# EAGLE schematic PCB dol (EAGLE 9.6.2)
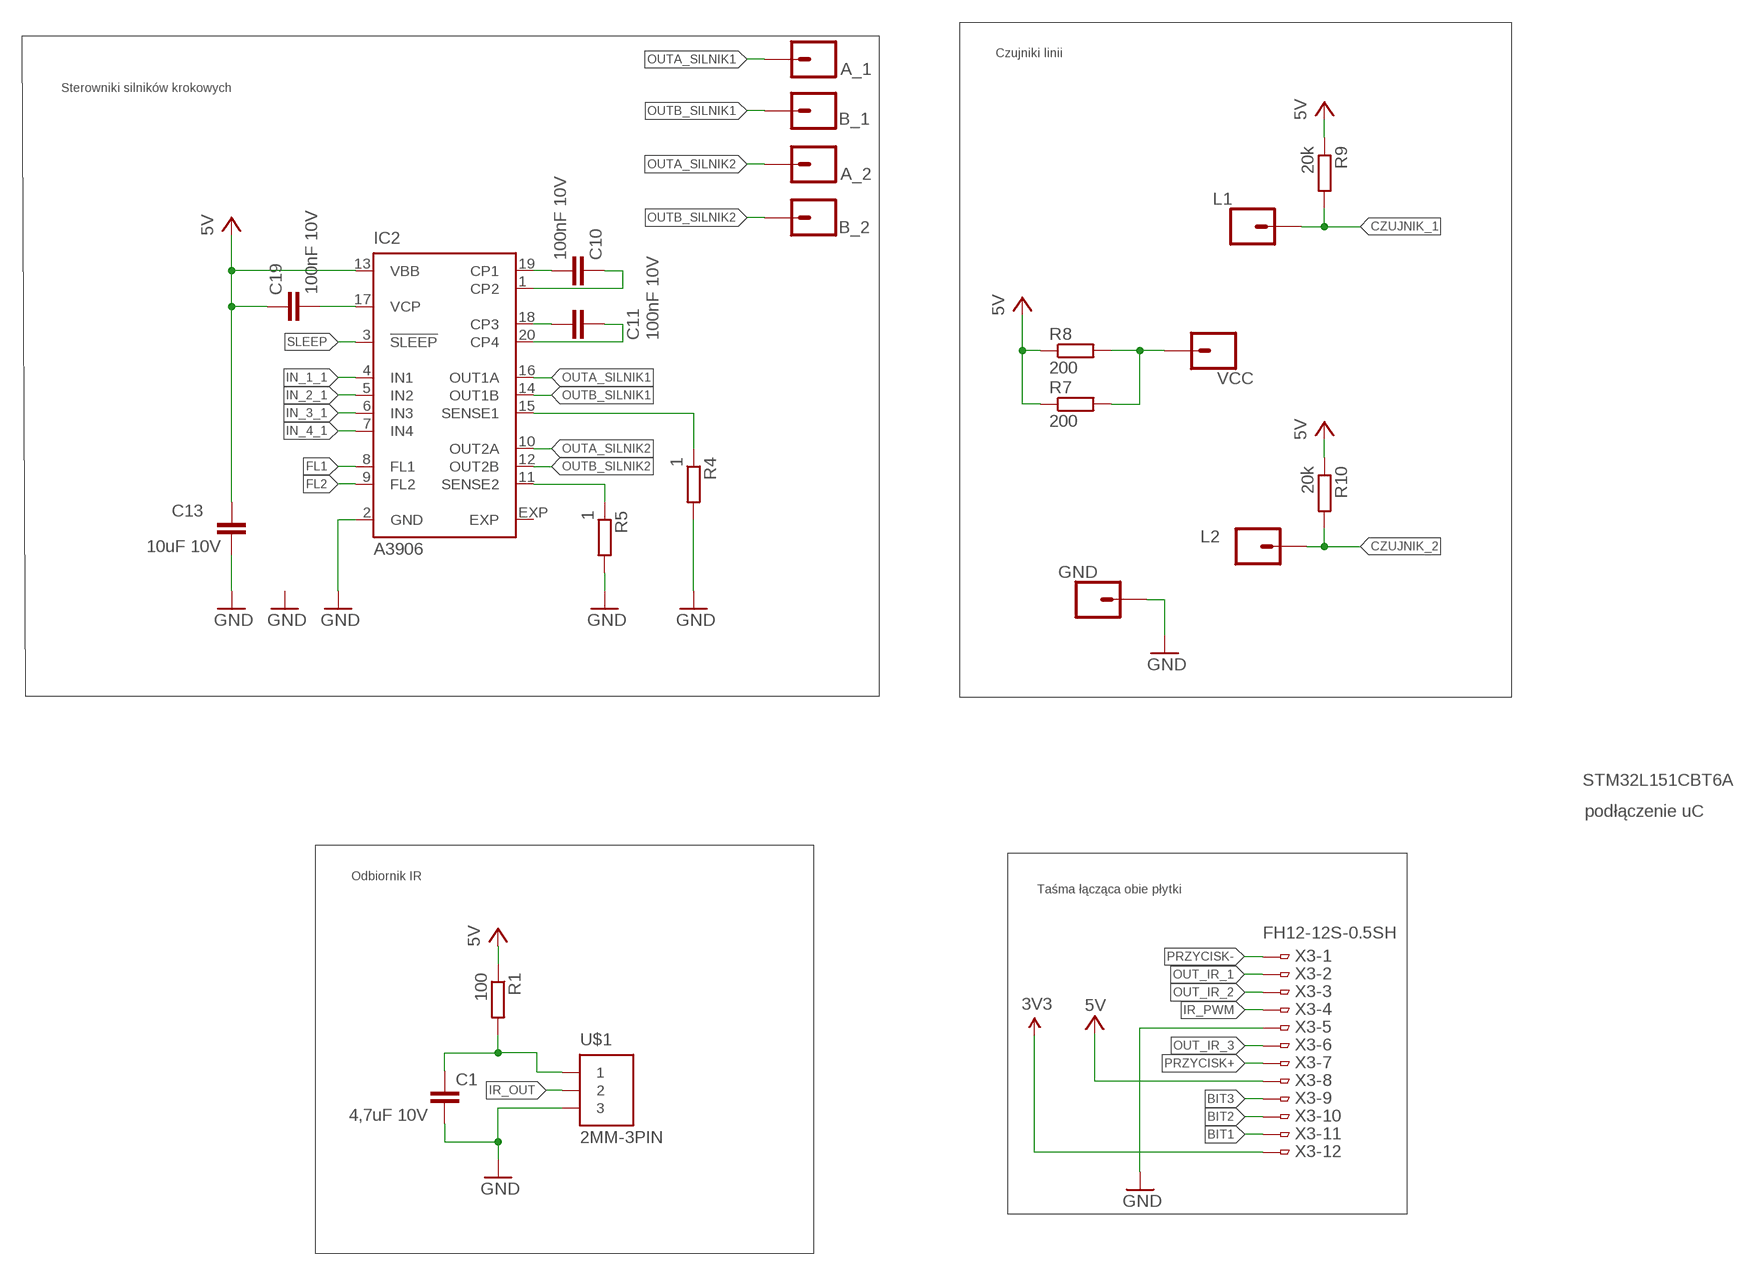
[diagram p0: schematic, sheet 1, part 1 of 2]
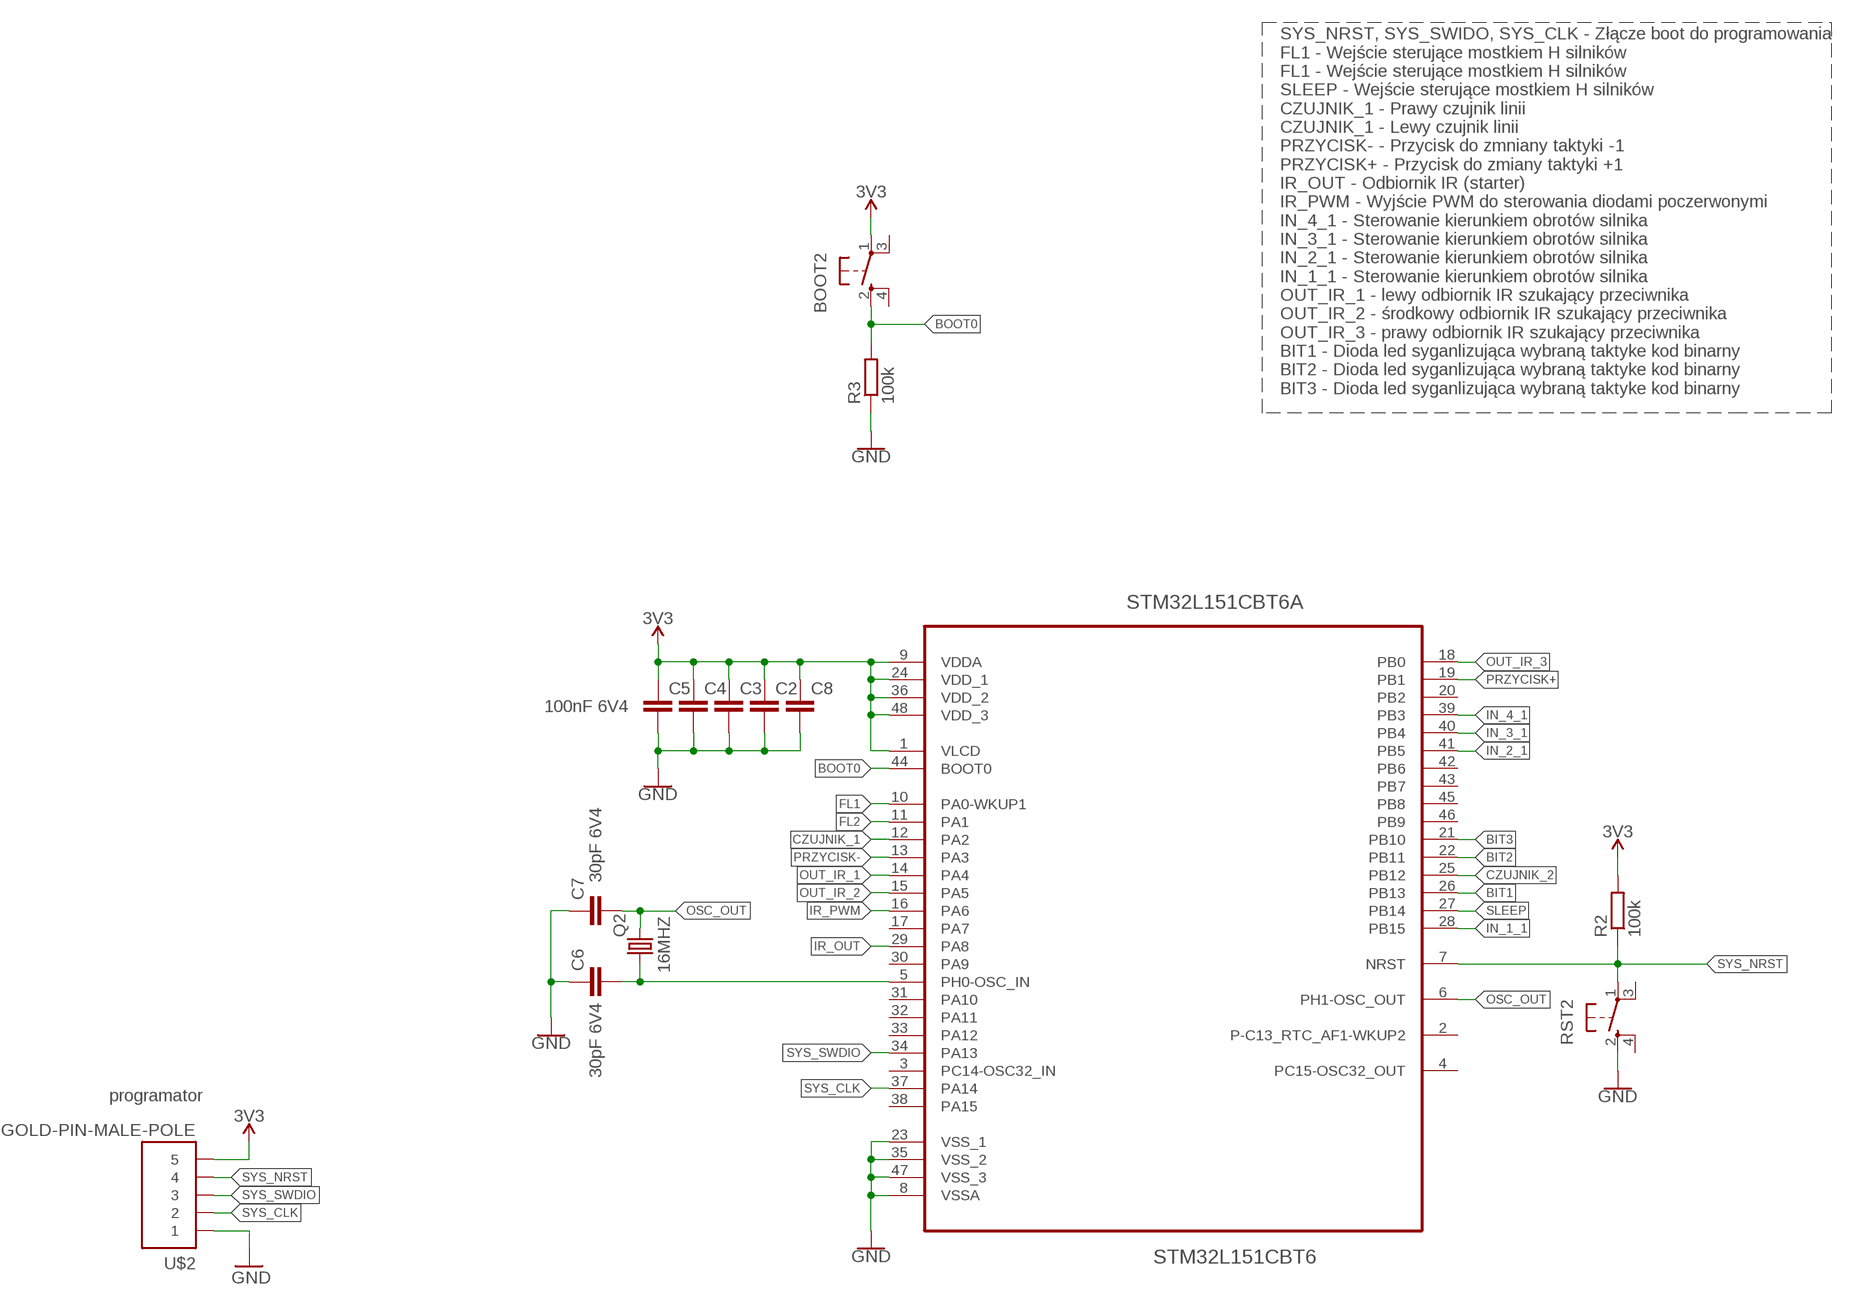
[diagram p1: schematic, sheet 1, part 2 of 2]

## Parts
A_1  CONN_01PTH_NO_SILK_KIT  [1X01NS_KIT]
A_2  CONN_01PTH_NO_SILK_KIT  [1X01NS_KIT]
B_1  CONN_01PTH_NO_SILK_KIT  [1X01NS_KIT]
B_2  CONN_01PTH_NO_SILK_KIT  [1X01NS_KIT]
BOOT2  SPST_TACT-KMR2  [KMR2]
C1  4,7uF 10V  C-EUC0402  [C0402]
C2  100nF 6V4  C-EUC0402  [C0402]
C3  100nF 6V4  C-EUC0402  [C0402]
C4  100nF 6V4  C-EUC0402  [C0402]
C5  100nF 6V4  C-EUC0402  [C0402]
C6  30pF 6V4  C-EUC0402  [C0402]
C7  30pF 6V4  C-EUC0402  [C0402]
C8  100nF 6V4  C-EUC0402  [C0402]
C10  100nF 10V  C-EUC0402  [C0402]
C11  100nF 10V  C-EUC0402  [C0402]
C13  10uF 10V  C-EUC0402  [C0402]
C19  100nF 10V  C-EUC0402  [C0402]
GND  CONN_01PTH_NO_SILK_KIT  [1X01NS_KIT]
IC2  A3906  [QFN20]
L1  CONN_01PTH_NO_SILK_KIT  [1X01NS_KIT]
L2  CONN_01PTH_NO_SILK_KIT  [1X01NS_KIT]
Q2  16MHZ  KX-7  [3.2X2.5_KX-7]
R1  100  R-EU_R0402  [R0402]
R2  100k  R-EU_R0402  [R0402]
R3  100k  R-EU_R0402  [R0402]
R4  1  R-EU_R0402  [R0402]
R5  1  R-EU_R0402  [R0402]
R7  200  R-EU_R0805  [R0805]
R8  200  R-EU_R0805  [R0805]
R9  20k  R-EU_R0402  [R0402]
R10  20k  R-EU_R0402  [R0402]
RST2  SPST_TACT-KMR2  [KMR2]
STM32L151CBT6A  STM32L151CBT6  [QFP50P900X900X160-48N]
U$1  2MM-3PIN  [2MM-3PIN]
U$2  GOLD-PIN-MALE-POLE  [PIN5]
VCC  CONN_01PTH_NO_SILK_KIT  [1X01NS_KIT]
X3  FH12-12S-0.5SH  [FH12-12S-0.5SH]

## Nets
3.3V: BOOT2.1(P) C2.1 C3.1 C4.1 C5.1 C8.1 R2.2 STM32L151CBT6A.1(VLCD) STM32L151CBT6A.9(VDDA) STM32L151CBT6A.24(VDD_1) STM32L151CBT6A.36(VDD_2) STM32L151CBT6A.48(VDD_3) U$2.P$5 X3.12 ; supply symbol labelled 3V3
BIT1: STM32L151CBT6A.26(PB13) X3.11
BIT2: STM32L151CBT6A.22(PB11) X3.10
BIT3: STM32L151CBT6A.21(PB10) X3.9
BOOT0: BOOT2.2(S) R3.2 STM32L151CBT6A.44(BOOT0)
CZUJNIK_1: L1.1 R9.2 STM32L151CBT6A.12(PA2)
CZUJNIK_2: L2.1 R10.2 STM32L151CBT6A.25(PB12)
FL1: IC2.8(FL1) STM32L151CBT6A.10(PA0-WKUP1)
FL2: IC2.9(FL2) STM32L151CBT6A.11(PA1)
GND: C1.2 C2.2 C3.2 C4.2 C5.2 C6.1 C7.1 C8.2 C13.1 GND.1 IC2.2(GND) R3.1 R4.2 R5.2 RST2.2(S) STM32L151CBT6A.8(VSSA) STM32L151CBT6A.23(VSS_1) STM32L151CBT6A.35(VSS_2) STM32L151CBT6A.47(VSS_3) U$1.P$3 U$2.P$1 X3.5
IN_1_1: IC2.4(IN1) STM32L151CBT6A.28(PB15)
IN_2_1: IC2.5(IN2) STM32L151CBT6A.41(PB5)
IN_3_1: IC2.6(IN3) STM32L151CBT6A.40(PB4)
IN_4_1: IC2.7(IN4) STM32L151CBT6A.39(PB3)
IR_OUT: STM32L151CBT6A.29(PA8) U$1.P$2
IR_PWM: STM32L151CBT6A.16(PA6) X3.4
N$1: C6.2 Q2.1 STM32L151CBT6A.5(PH0-OSC_IN)
N$2: C1.1 R1.2 U$1.P$1
N$3: IC2.11(SENSE2) R5.1
N$4: C10.2 IC2.1(CP2)
N$5: C11.2 IC2.20(CP4)
N$6: IC2.15(SENSE1) R4.1
N$12: R7.2 R8.2 VCC.1
N$26: C10.1 IC2.19(CP1)
N$27: C11.1 IC2.18(CP3)
N$32: C19.1 IC2.17(VCP)
OSC_OUT: C7.2 Q2.3 STM32L151CBT6A.6(PH1-OSC_OUT)
OUT_IR_1: STM32L151CBT6A.14(PA4) X3.2
OUT_IR_2: STM32L151CBT6A.15(PA5) X3.3
OUT_IR_3: STM32L151CBT6A.18(PB0) X3.6
OUTA_SILNIK1: A_1.1 IC2.16(OUT1A)
OUTA_SILNIK2: A_2.1 IC2.10(OUT2A)
OUTB_SILNIK1: B_1.1 IC2.14(OUT1B)
OUTB_SILNIK2: B_2.1 IC2.12(OUT2B)
PRZYCISK+: STM32L151CBT6A.19(PB1) X3.7
PRZYCISK-: STM32L151CBT6A.13(PA3) X3.1
SLEEP: IC2.3(!SLEEP) STM32L151CBT6A.27(PB14)
SYS_CLK: STM32L151CBT6A.37(PA14) U$2.P$2
SYS_NRST: R2.1 RST2.1(P) STM32L151CBT6A.7(NRST) U$2.P$4
SYS_SWDIO: STM32L151CBT6A.34(PA13) U$2.P$3
VCC: C13.2 C19.2 IC2.13(VBB) R1.1 R7.1 R8.1 R9.1 R10.1 X3.8 ; supply symbol labelled 5V
Unconnected: BOOT2.3(P1) BOOT2.4(S1) IC2.EXP RST2.3(P1) RST2.4(S1) STM32L151CBT6A.2(P-C13_RTC_AF1-WKUP2) STM32L151CBT6A.3(PC14-OSC32_IN) STM32L151CBT6A.4(PC15-OSC32_OUT) STM32L151CBT6A.17(PA7) STM32L151CBT6A.20(PB2) STM32L151CBT6A.30(PA9) STM32L151CBT6A.31(PA10) STM32L151CBT6A.32(PA11) STM32L151CBT6A.33(PA12) STM32L151CBT6A.38(PA15) STM32L151CBT6A.42(PB6) STM32L151CBT6A.43(PB7) STM32L151CBT6A.45(PB8) STM32L151CBT6A.46(PB9)

## Notes on the sheet
- Czujniki linii
- Sterowniki silników krokowych
- SYS_NRST, SYS_SWIDO, SYS_CLK - Złącze boot do programowania
  FL1 - Wejście sterujące mostkiem H silników
  FL1 - Wejście sterujące mostkiem H silników
  SLEEP - Wejście sterujące mostkiem H silników
  CZUJNIK_1 - Prawy czujnik linii
  CZUJNIK_1 - Lewy czujnik linii
  PRZYCISK- - Przycisk do zmniany taktyki -1
  PRZYCISK+ - Przycisk do zmiany taktyki +1
  IR_OUT - Odbiornik IR (starter)
  IR_PWM - Wyjście PWM do sterowania diodami poczerwonymi
  IN_4_1 - Sterowanie kierunkiem obrotów silnika
  IN_3_1 - Sterowanie kierunkiem obrotów silnika
  IN_2_1 - Sterowanie kierunkiem obrotów silnika
  IN_1_1 - Sterowanie kierunkiem obrotów silnika
  OUT_IR_1 - lewy odbiornik IR szukający przeciwnika
  OUT_IR_2 - środkowy odbiornik IR szukający przeciwnika
  OUT_IR_3 - prawy odbiornik IR szukający przeciwnika
  BIT1 - Dioda led syganlizująca wybraną taktyke kod binarny
  BIT2 - Dioda led syganlizująca wybraną taktyke kod binarny
  BIT3 - Dioda led syganlizująca wybraną taktyke kod binarny
- STM32L151CBT6A
- podłączenie uC
- Odbiornik IR
- Taśma łącząca obie płytki
- programator

## Library data of the parts
A_1 A_2 B_1 B_2 GND L1 L2 VCC = SparkFun-Connectors:CONN_01: Single connection point. Often used as Generic Header-pin footprint for 0.1 inch spaced/style header connections On any of the 0.1 inch spaced packages, you can populate with these: Break Away Headers - Straight <https://www.sparkfun.com/products/116> (PRT-00116) Break Away Male Headers - Right Angle <https://www.sparkfun.com/products/553> (PRT-00553) Female Headers <https://www.sparkfun.com/products/115> (PRT-00115) Break Away Headers - Machine Pin <https://www.sparkfun.com/products/117> (PRT-00117) Break Away Female Headers - Swiss Machine Pin <https://www.sparkfun.com/products/743> (PRT-00743) This device is also useful as a general connection point to wire up your design to another part of your project. Our various solder wires solder well into these plated through hole pads. Hook-Up Wire - Assortment (Stranded, 22 AWG) <https://www.sparkfun.com/products/11375> (PRT-11375) Hook-Up Wire - Assortment (Solid Core, 22 AWG) <https://www.sparkfun.com/products/11367> (PRT-11367) View the entire wire category on our website here <https://www.sparkfun.com/categories/141> Special notes: SMTSO-256-ET is a "flush mount" nut for a 4-40 screw. We mostly use this on specialty testbeds; it is a nice way to connect hardware to your PCB at an adjustable hieght. Also note, the SNAP packages are for using a snappable style connector. We sell a baggie of snaps and they are also used on two LilyPad designs: Snap Assortment - 30 pack (male and female) <https://www.sparkfun.com/products/11347> (DEV-11347) LilyPad Arduino SimpleSnap <https://www.sparkfun.com/products/10941> (DEV-10941) LilyPad SimpleSnap Protoboard <https://www.sparkfun.com/products/10940> (DEV-10940)
BOOT2 RST2 = adafruit:SPST_TACT: SMT 6mm switch, EVQQ2 series http://www.ladyada.net/library/eagle
C1-C8 C10 C11 C13 C19 = rcl:C-EU: CAPACITOR, European symbol; SPICEPREFIX: C
IC2 = allegro:A3906: Low Voltage Stepper and Single/Dual DC Motor Driver Data Sheet <http://www.allegromicro.com/en/Products/Part_Numbers/3906/3906.pdf>
Q2 = crystal-geyer_V1_0:KX: Quartz Crystals (MHz) SMD: KX - Serie Model Size l/w/h [mm] Frequency Range Frequency Stability Temp. Range [°C] Load Capacitance AECQ 200 availabel Datasheet KX-4 KX-5 KX-6 KX-7 KX-9A KX-9B KX-12A KX-12B KX-13 KX-20 KX-K KX-KS 1.6/1.2/0.3 2.0/1.6/0.45 2.5/2.0/0.55 3.2/2.5/0.8 5.0/3.2/1.0 5.0/3.2/1.1 6.0/3.5/1.1 6.0/3.5/1.0 7.0/5.0 /1.3 11.6/5.5/1.6 12.3/4.5/4.2 12.3/4.5/3.2 24.0 ~ 80.0 MHz 16.0 ~ 80.0 MHz 12.0 ~ 80.0 MHz 8.0 ~ 60.0 MHz 7,68 ~ 300,0 MHz 8,0 ~ 50,0 MHz 8,0 ~ 150,0 MHz 8,0 ~ 50,0 MHz 6,0 ~ 160,0 MHz 3,579 ~ 25,0 MHz 3,579 ~ 70,0 MHz 3,579 ~ 70,0 MHz ±10 … ±50ppm ±10 … ±50ppm ±10 … ±50ppm ±10 … ±50ppm ±10 … ±50ppm ±10 … ±50ppm ±10 … ±50ppm ±10 … ±50ppm ±10 … ±50ppm ±50ppm ±10 … ±50ppm ±10 … ±50ppm (*) -40°C …+85°C (*) -40°C …+125°C (*) -40°C …+125°C (*) -40°C …+125°C (*) -40°C …+105°C (*) -40°C …+105°C (*) -40°C …+125°C (*) -40°C …+105°C (*) -40°C …+105°C (*) -40°C …+105°C (*) -40°C …+85°C (*) -40°C …+85°C 8, 8…16 8, 8…16 10, 8…16 12, 7…20 16, 10…20 16, 10…20 16, 10…20 16, 12…20 16, 12…20 16, 12…20 16, 12…30 16, 12…30 - yes yes yes - - - - - - - - KX-4.pdf <http://www.geyer-electronic.de/uploads/tx_userartikelfrequenz/GEYER-KX-4.pdf> KX-5.pdf <http://www.geyer-electronic.de/uploads/tx_userartikelfrequenz/GEYER-KX-5.pdf> KX-6.pdf <http://www.geyer-electronic.de/uploads/tx_userartikelfrequenz/GEYER-KX-6.pdf> KX-7.pdf <http://www.geyer-electronic.de/uploads/tx_userartikelfrequenz/GEYER-KX-7.pdf> KX-9A.pdf <http://www.geyer-electronic.de/uploads/tx_userartikelfrequenz/GEYER-KX-9A.pdf> KX-9B.pdf <http://www.geyer-electronic.de/uploads/tx_userartikelfrequenz/GEYER-KX-9B.pdf> KX-12A.pdf <http://www.geyer-electronic.de/uploads/tx_userartikelfrequenz/GEYER-KX-12A.pdf> KX-12B.pdf <http://www.geyer-electronic.de/uploads/tx_userartikelfrequenz/GEYER-KX-12B.pdf> KX-13.pdf <http://www.geyer-electronic.de/uploads/tx_userartikelfrequenz/GEYER-KX-13.pdf> KX-20.pdf <http://www.geyer-electronic.de/uploads/tx_userartikelfrequenz/GEYER-KX-20.pdf> KX-K.pdf <http://www.geyer-electronic.de/uploads/tx_userartikelfrequenz/GEYER-KX-K.pdf> KX-KS.pdf <http://www.geyer-electronic.de/uploads/tx_userartikelfrequenz/GEYER-KX-KS.pdf> <http://www.geyer-electronic.de/fileadmin/template/img/logo-geyer-electronic.png> Details see: http://www.geyer-electronic.de/Frequenz-Produkte.9.0.html Created 2016-06-07, Hans Locher 2016 (C) Geyer Quartz Technology KX4,KX5,KX6,KX7,KX9A,KX9B,KX12A,KX12B,KX13,KX20,KXK,KXKS;1612;2016;2520;3225;5032;6035;7050;11655;12345;1,6x1,2;2,0x1,6;2,5x2,0;3,2x2,5;5,0x3,2;6,0x3,5;7,0x5,0;11,6x5,5;12,3x4,5;12,3x4,5;1.6x1.2;2.0x1.6;2.5x2.0;3.2x2.5;5.0x3.2;6.0x3.5;7.0x5.0;11.6x5.5;12.3x4.5;12.3x4.5;
R1-R5 R7-R10 = rcl:R-EU_: RESISTOR, European symbol; SPICEPREFIX: R
STM32L151CBT6A = ST Microelctronics_By_element14_Batch_1:STM32L151CBT6: ARM-based 32-bit MCU; MPN: STM32L151CBT6; OC_FARNELL: 2060925; OC_NEWARK: 65T3786; PACKAGE: LQFP-48; SUPPLIER: STMICROELECTRONICS
U$1 = 2mm-piny:2MM-3PIN
U$2 = gold-pin-male-pole:GOLD-PIN-MALE-POLE
X3 = con-hirose:FH12-12S-0.5S: 0.5mm Pitch Connectors For FPC/FFC Source: Data sheet <http://www.hirose.co.jp/cataloge_hp/e58605370.pdf>; MPN: FH12-12S-0.5SH(55); OC_FARNELL: 1324542; OC_NEWARK: 34M6155